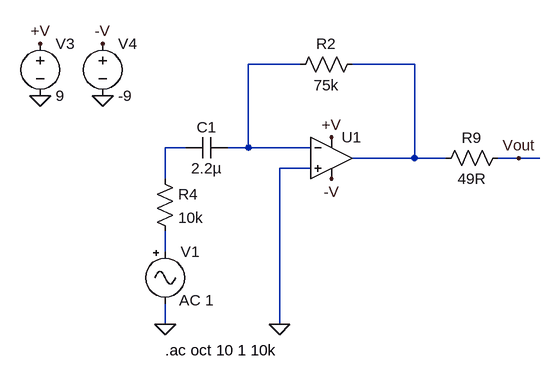
[diagram p0: schematic AnalogFilterV3.asc]
AnalogFilterV3.asc, the LTspice schematic file:
Version 4
SHEET 1 2280 680
WIRE 448 -176 368 -176
WIRE 624 -176 528 -176
WIRE 272 -48 240 -48
WIRE 368 -48 368 -176
WIRE 368 -48 336 -48
WIRE 464 -48 368 -48
WIRE 624 -32 624 -176
WIRE 624 -32 528 -32
WIRE 672 -32 624 -32
WIRE 784 -32 752 -32
WIRE 816 -32 784 -32
WIRE 464 -16 416 -16
WIRE 240 0 240 -48
WIRE 240 112 240 80
WIRE 240 224 240 192
WIRE 416 224 416 -16
FLAG 240 224 0
FLAG 416 224 0
FLAG 496 -64 +V
FLAG 496 0 -V
FLAG 48 -128 0
FLAG 144 -128 0
FLAG 48 -208 +V
FLAG 144 -208 -V
FLAG 784 -32 Vout
SYMBOL Misc\\signal 240 96 R0
WINDOW 3 37 58 Left 2
WINDOW 123 22 91 Left 2
WINDOW 39 0 0 Left 0
SYMATTR Value ""
SYMATTR Value2 AC 1
SYMATTR InstName V1
SYMBOL cap 272 -32 R270
WINDOW 0 32 32 VTop 2
WINDOW 3 0 32 VBottom 2
SYMATTR InstName C1
SYMATTR Value 2.2µ
SYMBOL OpAmps\\UniversalOpAmp 496 -32 R0
SYMATTR InstName U1
SYMBOL res 432 -160 R270
WINDOW 0 32 56 VTop 2
WINDOW 3 0 56 VBottom 2
SYMATTR InstName R2
SYMATTR Value 75k
SYMBOL voltage 48 -224 R0
WINDOW 123 0 0 Left 0
WINDOW 39 0 0 Left 0
SYMATTR InstName V3
SYMATTR Value 9
SYMBOL voltage 144 -224 R0
WINDOW 123 0 0 Left 0
WINDOW 39 0 0 Left 0
SYMATTR InstName V4
SYMATTR Value -9
SYMBOL res 224 -16 R0
SYMATTR InstName R4
SYMATTR Value 10k
SYMBOL res 768 -48 R90
WINDOW 0 0 56 VBottom 2
WINDOW 3 32 56 VTop 2
SYMATTR InstName R9
SYMATTR Value 49R
TEXT 240 264 Left 2 !.ac oct 10 1 10k

The netlist it stands for:
* AnalogFilterV3.asc
V1 N004 0 AC 1
C1 N003 N001 2.2µ
XU1 0 N001 +V -V N002 level1 Avol=1Meg GBW=10Meg Vos=0 En=0 Enk=0 In=0 Ink=0 Rin=500Meg  ; pins In+ In- V+ V- OUT
R2 N001 N002 75k
V3 +V 0 9
V4 -V 0 -9
R4 N003 N004 10k
R9 Vout N002 49R
.ac oct 10 1 10k
.lib UniversalOpAmp1.lib
.backanno
.end